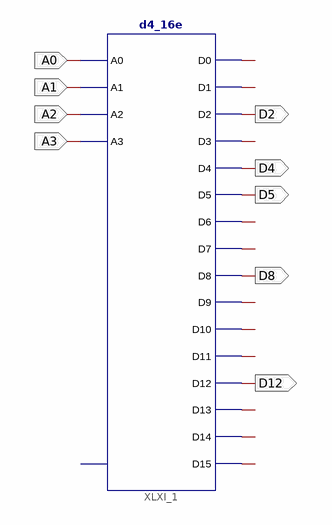
[diagram p0: schematic sheet 1]
// Xilinx ISE schematic Ex1.sch (spartan3e) as structural Verilog: 1 symbols, 9 ports
module Ex1 (
  input  A0,
  input  A1,
  input  A2,
  input  A3,
  output D2,
  output D4,
  output D5,
  output D8,
  output D12
);

  wire D0, D1, D3, D6, D7, D9, D10, D11, D13, D14, D15;

  d4_16e XLXI_1 (
    .A0(A0), .A1(A1), .A2(A2), .A3(A3), .D0(D0), .D1(D1), .D10(D10), .D11(D11), .D12(D12), .D13(D13),
    .D14(D14), .D15(D15), .D2(D2), .D3(D3), .D4(D4), .D5(D5), .D6(D6), .D7(D7), .D8(D8), .D9(D9));  // open: E
endmodule
